# Altium schematic sheet ulchich-variant.SchDoc
size 297 x 209 mm
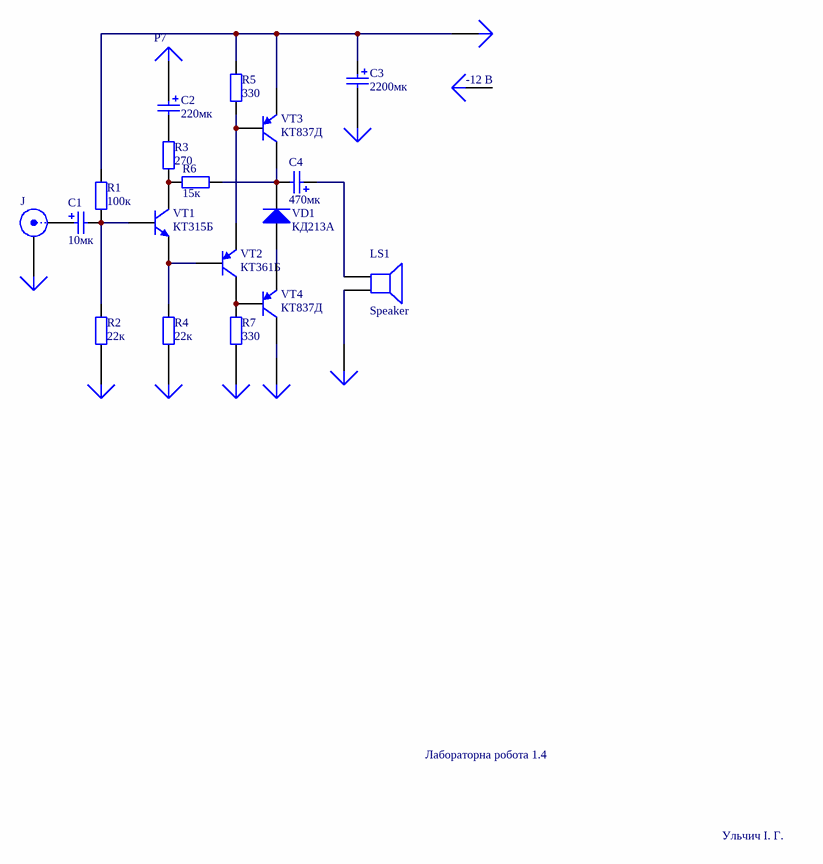
[diagram p0: ulchich-variant.SchDoc]

## Parts
C1  value 10мк  [CAPPA14.05-10.5x6.3]  (hidden comment: Cap Pol2)
C2  value 220мк  [CAPPA14.05-10.5x6.3]  (hidden comment: Cap Pol2)
C3  value 2200мк  [CAPPA14.05-10.5x6.3]  (hidden comment: Cap Pol2)
C4  value 470мк  [CAPPA14.05-10.5x6.3]  (hidden comment: Cap Pol2)
J  BNC  [BNC_RA CON]  (value not drawn)
LS1  Speaker  [PIN2]
P1  Plug  [PIN1]  (value not drawn)
P2  Plug  [PIN1]  (value not drawn)
P3  Plug  [PIN1]  (value not drawn)
P4  Plug  [PIN1]  (value not drawn)
P5  Plug  [PIN1]  (value not drawn)
P6  Plug  [PIN1]  (value not drawn)
P7  Plug  [PIN1]  (value not drawn)
P8  Plug  [PIN1]  (value not drawn)
P9  Plug  [PIN1]  (value not drawn)
P10  -12 В  [PIN1]
R1  value 100к  [AXIAL-0.4]  (hidden comment: Res2)
R2  value 22к  [AXIAL-0.4]  (hidden comment: Res2)
R3  value 270  [AXIAL-0.4]  (hidden comment: Res2)
R4  value 22к  [AXIAL-0.4]  (hidden comment: Res2)
R5  value 330  [AXIAL-0.4]  (hidden comment: Res2)
R6  value 15к  [AXIAL-0.4]  (hidden comment: Res2)
R7  value 330  [AXIAL-0.4]  (hidden comment: Res2)
VD1  КД213А  [SMC]
VT1  КТ315Б  [TO-226]
VT2  КТ361Б  [SOT-23B]
VT3  КТ837Д  [SOT-23B]
VT4  КТ837Д  [SOT-23B]

## Nets
NetC1_1: C1.1 J.1(X)
NetC1_2: C1.2 R1.1 R2.2 VT1.2(B)
NetC2_1: C2.1 P7.1
NetC2_2: C2.2 R3.2
NetC3_1: C3.1 P6.1 R1.2 R5.2 VT3.3(E)
NetC3_2: C3.2 P1.1
NetC4_1: C4.1 LS1.1
NetC4_2: C4.2 R6.2 VD1.2(K) VT3.1(C)
NetJ_2: J.2(Y) P9.1
NetLS1_2: LS1.2 P2.1
NetP3_1: P3.1 R7.1
NetP4_1: P4.1 R4.1
NetP5_1: P5.1 R2.1
NetP8_1: P8.1 VT4.1(C)
NetR3_1: R3.1 R6.1 VT1.1(C)
NetR4_2: R4.2 VT1.3(E) VT2.2(B)
NetR5_1: R5.1 VT2.3(E) VT3.2(B)
NetR7_2: R7.2 VT2.1(C) VT4.2(B)
NetVD1_1: VD1.1(A) VT4.3(E)

Not connected (* = marked no-connect by the designer): P10 1

## Notes on the sheet
- Лабораторна робота 1.4
- Ульчич І. Г.

## Library data of the parts
C1-C4 = Cap Pol2: Polarized Capacitor (Axial); Published: 8-Jun-2000; LatestRevisionDate: 17-Jul-2002; LatestRevisionNote: Re-released for DXP Platform.; PackageReference: POLAR0.8; Publisher: Altium Limited
J = BNC: BNC Elbow Connector; LatestRevisionDate: 17-Jul-2002; LatestRevisionNote: Re-released for DXP Platform.; Publisher: Altium Limited
LS1 = Speaker: Loudspeaker; Published: 24-Mar-1999; LatestRevisionDate: 17-Jul-2002; LatestRevisionNote: Re-released for DXP Platform.; PackageReference: PIN2; Publisher: Altium Limited
P10 = Plug: LatestRevisionDate: 17-Jul-2002; LatestRevisionNote: Re-released for DXP Platform.; Publisher: Altium Limited
R1-R7 = Res2: Resistor; Published: 8-Jun-2000; LatestRevisionDate: 17-Jul-2002; LatestRevisionNote: Re-released for DXP Platform.; PackageReference: AXIAL-0.4; Publisher: Altium Limited
VD1 = Diode: Default Diode; Published: 8-Jun-2000; LatestRevisionDate: 17-Jul-2002; LatestRevisionNote: Re-released for DXP Platform.; PackageDocument: Sep-1996; PackageReference: SMC; Publisher: Altium Limited; Code_JEDEC: DO-214-AB
VT1 = NPN: NPN Bipolar Transistor; Published: 8-Jun-2000; LatestRevisionDate: 17-Jul-2002; LatestRevisionNote: Re-released for DXP Platform.; PackageReference: TO-226; Publisher: Altium Limited; Code_JEDEC: TO-226-AA
VT2-VT4 = PNP: PNP Bipolar Transistor; Published: 8-Jun-2000; LatestRevisionDate: 17-Jul-2002; LatestRevisionNote: Re-released for DXP Platform.; PackageReference: SOT-23B; Publisher: Altium Limited; Code_JEDEC: SOT-23
P1-P9 = Plug: LatestRevisionDate: 17-Jul-2002; LatestRevisionNote: Re-released for DXP Platform.; Publisher: Altium Limited